# Altium schematic sheet Motor.SchDoc
size A4
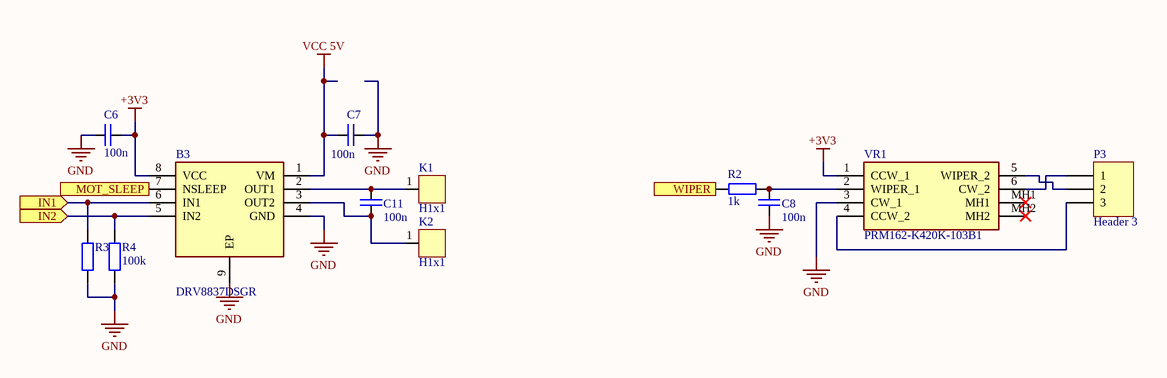
[diagram p0: Motor.SchDoc]

## Parts
B3  DRV8837DSGR  [SON50P200X200X80-9N]
C6  100n  [R1005_0402i_M]
C7  100n  [R1005_0402i_M]
C8  100n  [R1005_0402i_M]
C11  100n  [R1005_0402i_M]
K1  H1x1  [H1x1]
K2  H1x1  [H1x1]
P3  Header 3  [HDR1X3]
R2  1k  [R1005_0402i_L]
R3  100k  [R1005_0402i_L]  (value not drawn)
R4  100k  [R1005_0402i_L]
VR1  PRM162-K420K-103B1  [PRM162K415K103B1]

## Ports
IN1 (in), IN2 (in), MOT_SLEEP (in), WIPER (out)

## Nets
+3V3: B3.8(VCC) C6.2 VR1.1(CCW_1)
GND: B3.4(GND) B3.9(EP) C6.1 C7.2 C8.2 R3.2 R4.2 VR1.3(CW_1)
VCC 5V: B3.1(VM) C7.1
IN1: B3.6(IN1) R3.1 ; port IN1
IN2: B3.5(IN2) R4.1 ; port IN2
MOT_SLEEP: B3.7(NSLEEP) ; port MOT_SLEEP
WIPER: R2.1 ; port WIPER
NetB3_2: B3.2(OUT1) C11.2 K1.1
NetB3_3: B3.3(OUT2) C11.1 K2.1
NetC8_1: C8.1 R2.2 VR1.2(WIPER_1)
NetP3_1: P3.1 VR1.6(CW_2)
NetP3_2: P3.2 VR1.5(WIPER_2)
NetP3_3: P3.3 VR1.4(CCW_2)

Not connected (* = marked no-connect by the designer): VR1 MH1* MH2*

## Library data of the parts
B3 = DRV8837DSGR: 1.8A Low Voltage Brushed DC Motor Driver (PWM Ctrl); Manufacturer_Name: Texas Instruments; Geometry.Height: 0.8mm; Mouser Part Number: 595-DRV8837DSGR; Mouser Price/Stock: https://www.mouser.co.uk/ProductDetail/Texas-Instruments/DRV8837DSGR?qs=l6ZoeTYLMwO0pKIJ8222Ww%3D%3D; Manufacturer_Part_Number: DRV8837DSGR; Datasheet Link: http://www.ti.com/lit/gpn/drv8837
C6-C8 C11 = C: Capacitor
K1 K2 = H1x1: Header 1x1 (male)
P3 = Header 3: Header, 3-Pin; LatestRevisionDate: 17-Jul-2002; LatestRevisionNote: Re-released for DXP Platform.; Publisher: Altium Limited
R2-R4 = R
VR1 = PRM162-K420K-103B1: Variable Resistor; Manufacturer_Name: Bourns; Datasheet Link: https://www.bourns.com/docs/product-datasheets/PDB18.pdf; Height: 28.5mm; Manufacturer_Part_Number: PRM162-K420K-103B1; Mouser Part Number: 652-PRM162K420K103B1; Mouser Price/Stock: https://www.mouser.co.uk/ProductDetail/Bourns/PRM162-K420K-103B1?qs=U%2FacTlguYxaZbpiLvzzeCA%3D%3D; Arrow Part Number: PRM162-K420K-103B1; Arrow Price/Stock: https://www.arrow.com/en/products/prm162-k420k-103b1/bourns?region=nac